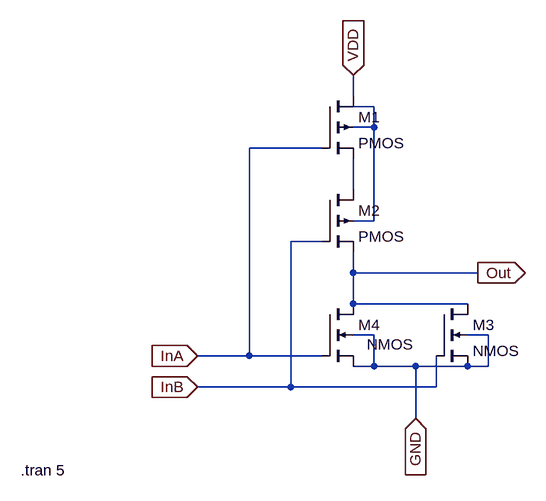
[diagram p0: schematic NOR_2.asc]
NOR_2.asc, the LTspice schematic file:
Version 4
SHEET 1 880 704
WIRE 224 96 224 64
WIRE 256 112 224 112
WIRE 256 144 256 112
WIRE 256 144 224 144
WIRE 176 176 64 176
WIRE 224 240 224 192
WIRE 256 288 256 144
WIRE 256 288 224 288
WIRE 176 320 128 320
WIRE 224 368 224 336
WIRE 416 368 224 368
WIRE 224 416 224 368
WIRE 400 416 224 416
WIRE 224 432 224 416
WIRE 256 464 224 464
WIRE 432 464 400 464
WIRE 64 496 64 176
WIRE 64 496 -16 496
WIRE 176 496 64 496
WIRE 256 512 256 464
WIRE 256 512 224 512
WIRE 320 512 256 512
WIRE 400 512 320 512
WIRE 432 512 432 464
WIRE 432 512 400 512
WIRE 128 544 128 320
WIRE 128 544 -16 544
WIRE 352 544 352 496
WIRE 352 544 128 544
WIRE 320 592 320 512
FLAG 416 368 Out
IOPIN 416 368 Out
FLAG -16 496 InA
IOPIN -16 496 In
FLAG -16 544 InB
IOPIN -16 544 In
FLAG 224 64 VDD
IOPIN 224 64 In
FLAG 320 592 GND
IOPIN 320 592 In
SYMBOL pmos4 176 96 R0
SYMATTR InstName M1
SYMBOL pmos4 176 240 R0
SYMATTR InstName M2
SYMBOL nmos4 176 416 R0
WINDOW 3 69 62 Left 2
SYMATTR InstName M4
SYMBOL nmos4 352 416 R0
SYMATTR InstName M3
TEXT -288 672 Left 2 !.tran 5

The netlist it stands for:
* NOR_2.asc
M1 VDD InA N002 N001 PMOS
M2 N002 InB Out N001 PMOS
M4 Out InA GND GND NMOS
M3 Out InB GND GND NMOS
.model NMOS NMOS
.model PMOS PMOS
.lib standard.mos
.tran 5
.backanno
.end